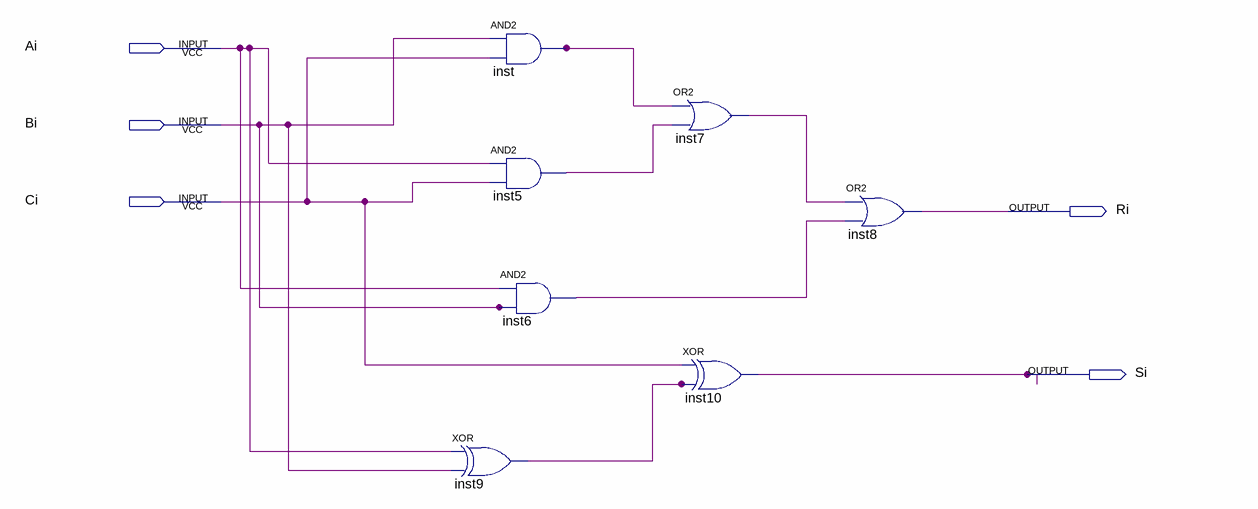
[diagram p0: schematic sheet]
// Quartus schematic Block1.bdf as structural Verilog: 7 symbols, 5 pins
module Block1 (
  input  Ai,
  input  Bi,
  input  Ci,
  output Ri,
  output Si
);

  wire inst5_out, inst6_out, inst7_out, inst9_out, inst_out;

  and inst (inst_out, Bi, Ci);
  and inst5 (inst5_out, Ai, Ci);
  xor inst9 (inst9_out, Ai, Bi);
  and inst6 (inst6_out, Ai, Bi);
  or inst7 (inst7_out, inst_out, inst5_out);
  xor inst10 (Si, Ci, inst9_out);
  or inst8 (Ri, inst7_out, inst6_out);
endmodule
